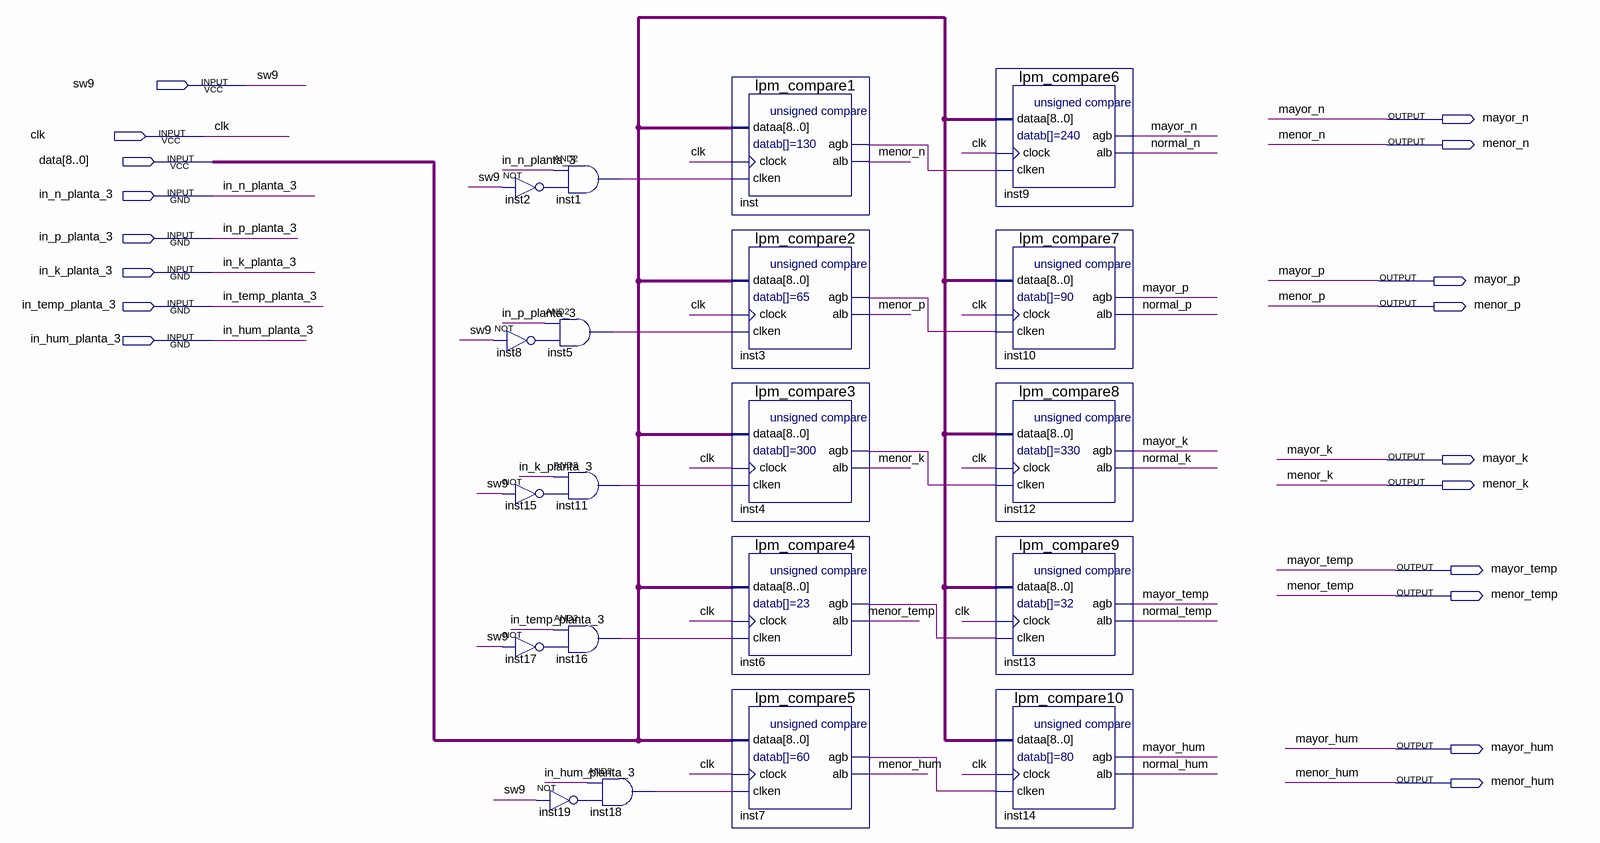
[diagram p0: schematic sheet]
// Quartus schematic Comparador_planta_3.bdf as structural Verilog: 20 symbols, 18 pins
module Comparador_planta_3 (
  input  sw9,
  input  clk,
  input  [8:0] data,
  input  in_n_planta_3,
  input  in_p_planta_3,
  input  in_k_planta_3,
  input  in_temp_planta_3,
  input  in_hum_planta_3,
  output mayor_n,
  output menor_n,
  output mayor_p,
  output menor_p,
  output mayor_k,
  output menor_k,
  output mayor_temp,
  output menor_temp,
  output mayor_hum,
  output menor_hum
);

  wire inst1_out, inst2_out, inst3_agb, inst4_agb, inst5_out, inst6_agb, inst7_agb, inst8_out, inst11_out,
       inst15_out, inst16_out, inst17_out, inst18_out, inst19_out, inst_agb, normal_hum, normal_k, normal_n,
       normal_p, normal_temp;

  not inst2 (inst2_out, sw9);
  not inst8 (inst8_out, sw9);
  not inst15 (inst15_out, sw9);
  not inst17 (inst17_out, sw9);
  not inst19 (inst19_out, sw9);
  and inst1 (inst1_out, in_n_planta_3, inst2_out);
  and inst5 (inst5_out, in_p_planta_3, inst8_out);
  and inst11 (inst11_out, in_k_planta_3, inst15_out);
  and inst16 (inst16_out, in_temp_planta_3, inst17_out);
  and inst18 (inst18_out, in_hum_planta_3, inst19_out);
  lpm_compare1 inst (.dataa(data), .clock(clk), .clken(inst1_out), .agb(inst_agb), .alb(menor_n));
  lpm_compare2 inst3 (.dataa(data), .clock(clk), .clken(inst5_out), .agb(inst3_agb), .alb(menor_p));
  lpm_compare3 inst4 (.dataa(data), .clock(clk), .clken(inst11_out), .agb(inst4_agb), .alb(menor_k));
  lpm_compare4 inst6 (.dataa(data), .clock(clk), .clken(inst16_out), .agb(inst6_agb), .alb(menor_temp));
  lpm_compare5 inst7 (.dataa(data), .clock(clk), .clken(inst18_out), .agb(inst7_agb), .alb(menor_hum));
  lpm_compare6 inst9 (.dataa(data), .clock(clk), .clken(inst_agb), .agb(mayor_n), .alb(normal_n));
  lpm_compare7 inst10 (.dataa(data), .clock(clk), .clken(inst3_agb), .agb(mayor_p), .alb(normal_p));
  lpm_compare8 inst12 (.dataa(data), .clock(clk), .clken(inst4_agb), .agb(mayor_k), .alb(normal_k));
  lpm_compare9 inst13 (.dataa(data), .clock(clk), .clken(inst6_agb), .agb(mayor_temp), .alb(normal_temp));
  lpm_compare10 inst14 (.dataa(data), .clock(clk), .clken(inst7_agb), .agb(mayor_hum), .alb(normal_hum));
endmodule
